# Altium schematic sheet 6-Power.SchDoc
size A4
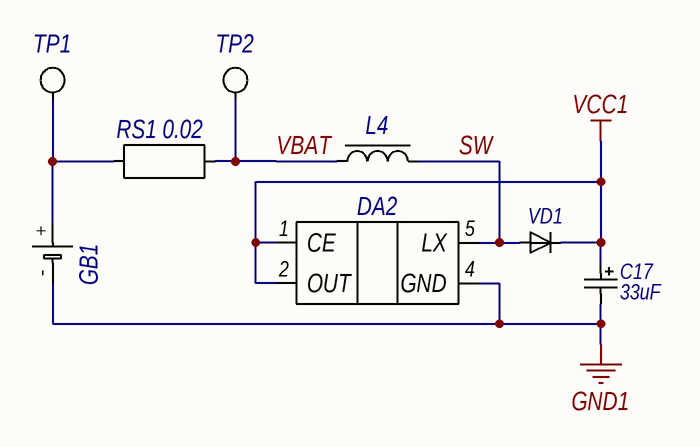
[diagram p0: 6-Power.SchDoc]

## Parts
C17  33uF  [CAP_TYPE_A]
DA2  NCP1400A  [SOT23-5]  (value not drawn)
GB1  Battery  [AAA Holder_1]  (value not drawn)
L4  (no value)  [SRN5040]
RS1  value 0.02  [CHIP_0805_R]  (hidden comment: Резистор)  (no BOM)
TP1  TEST_POINT  [Pad_1]  (value not drawn)  (no BOM)
TP2  TEST_POINT  [Pad_1]  (value not drawn)  (no BOM)
VD1  STPS0520Z  [SOD123]  (value not drawn)

## Nets
GND1: C17.2 DA2.4(GND) GB1.-
VCC1: C17.1 DA2.1(CE) DA2.2(OUT) VD1.K
SW: DA2.5(LX) L4.2 VD1.A
VBAT: L4.1 RS1.2 TP2.1
NetGB1_+: GB1.+ RS1.1 TP1.1

## Library data of the parts
C17 = C_POL: Конденсатор полярный; PartNumber: T491A336K006AT; Voltage, V: *; Tolerance, %: *; Value: 33uF
DA2 = NCP1400A: PSIC, Low-Power Step-Up Converter; Mfg: ONS; PartNumber: NCP1400A
GB1 = Battery: PartNumber: Custom
L4 = Ind_core: Дроссель с сердечником; PartNumber: VLCF4028T-220MR72-2; Mfg: TDK
RS1 = Резистор: PartNumber: 0R02 0.5%; Mfg: *
VD1 = Diode: Диод; Mfg: ST; PartNumber: STPS0520Z